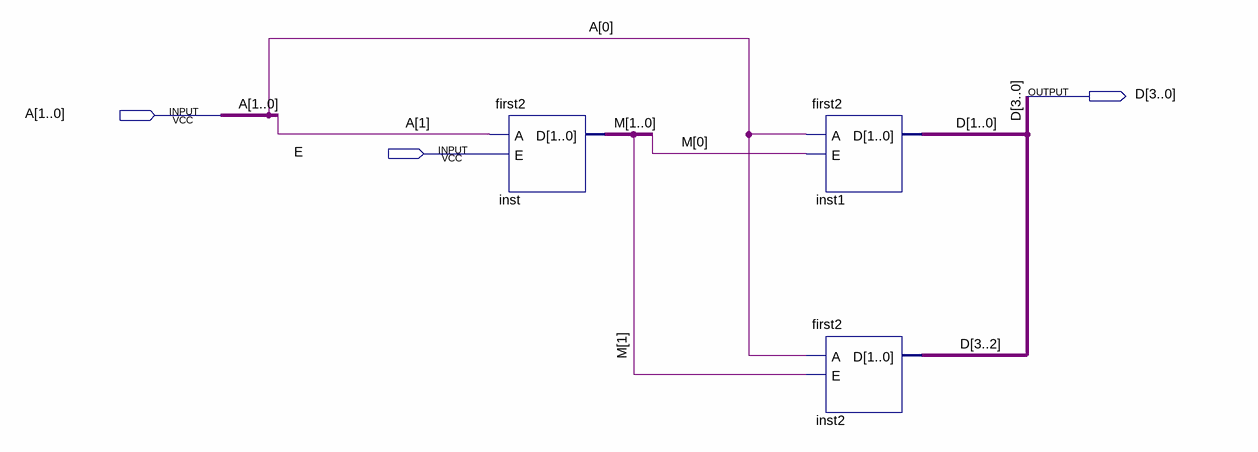
[diagram p0: schematic sheet]
// Quartus schematic first3.bdf as structural Verilog: 3 symbols, 3 pins
module first3 (
  input  [1:0] A,
  input  E,
  output [3:0] D
);

  wire [1:0] M;

  first2 inst (.A(A[1]), .E(E), .D(M));
  first2 inst1 (.A(A[0]), .E(M[0]), .D(D[1:0]));
  first2 inst2 (.A(A[0]), .E(M[1]), .D(D[3:2]));
endmodule
